# Altium schematic sheet Mainsystem.SchDoc
size A3; SheetNumber: 4; SheetTotal: 7
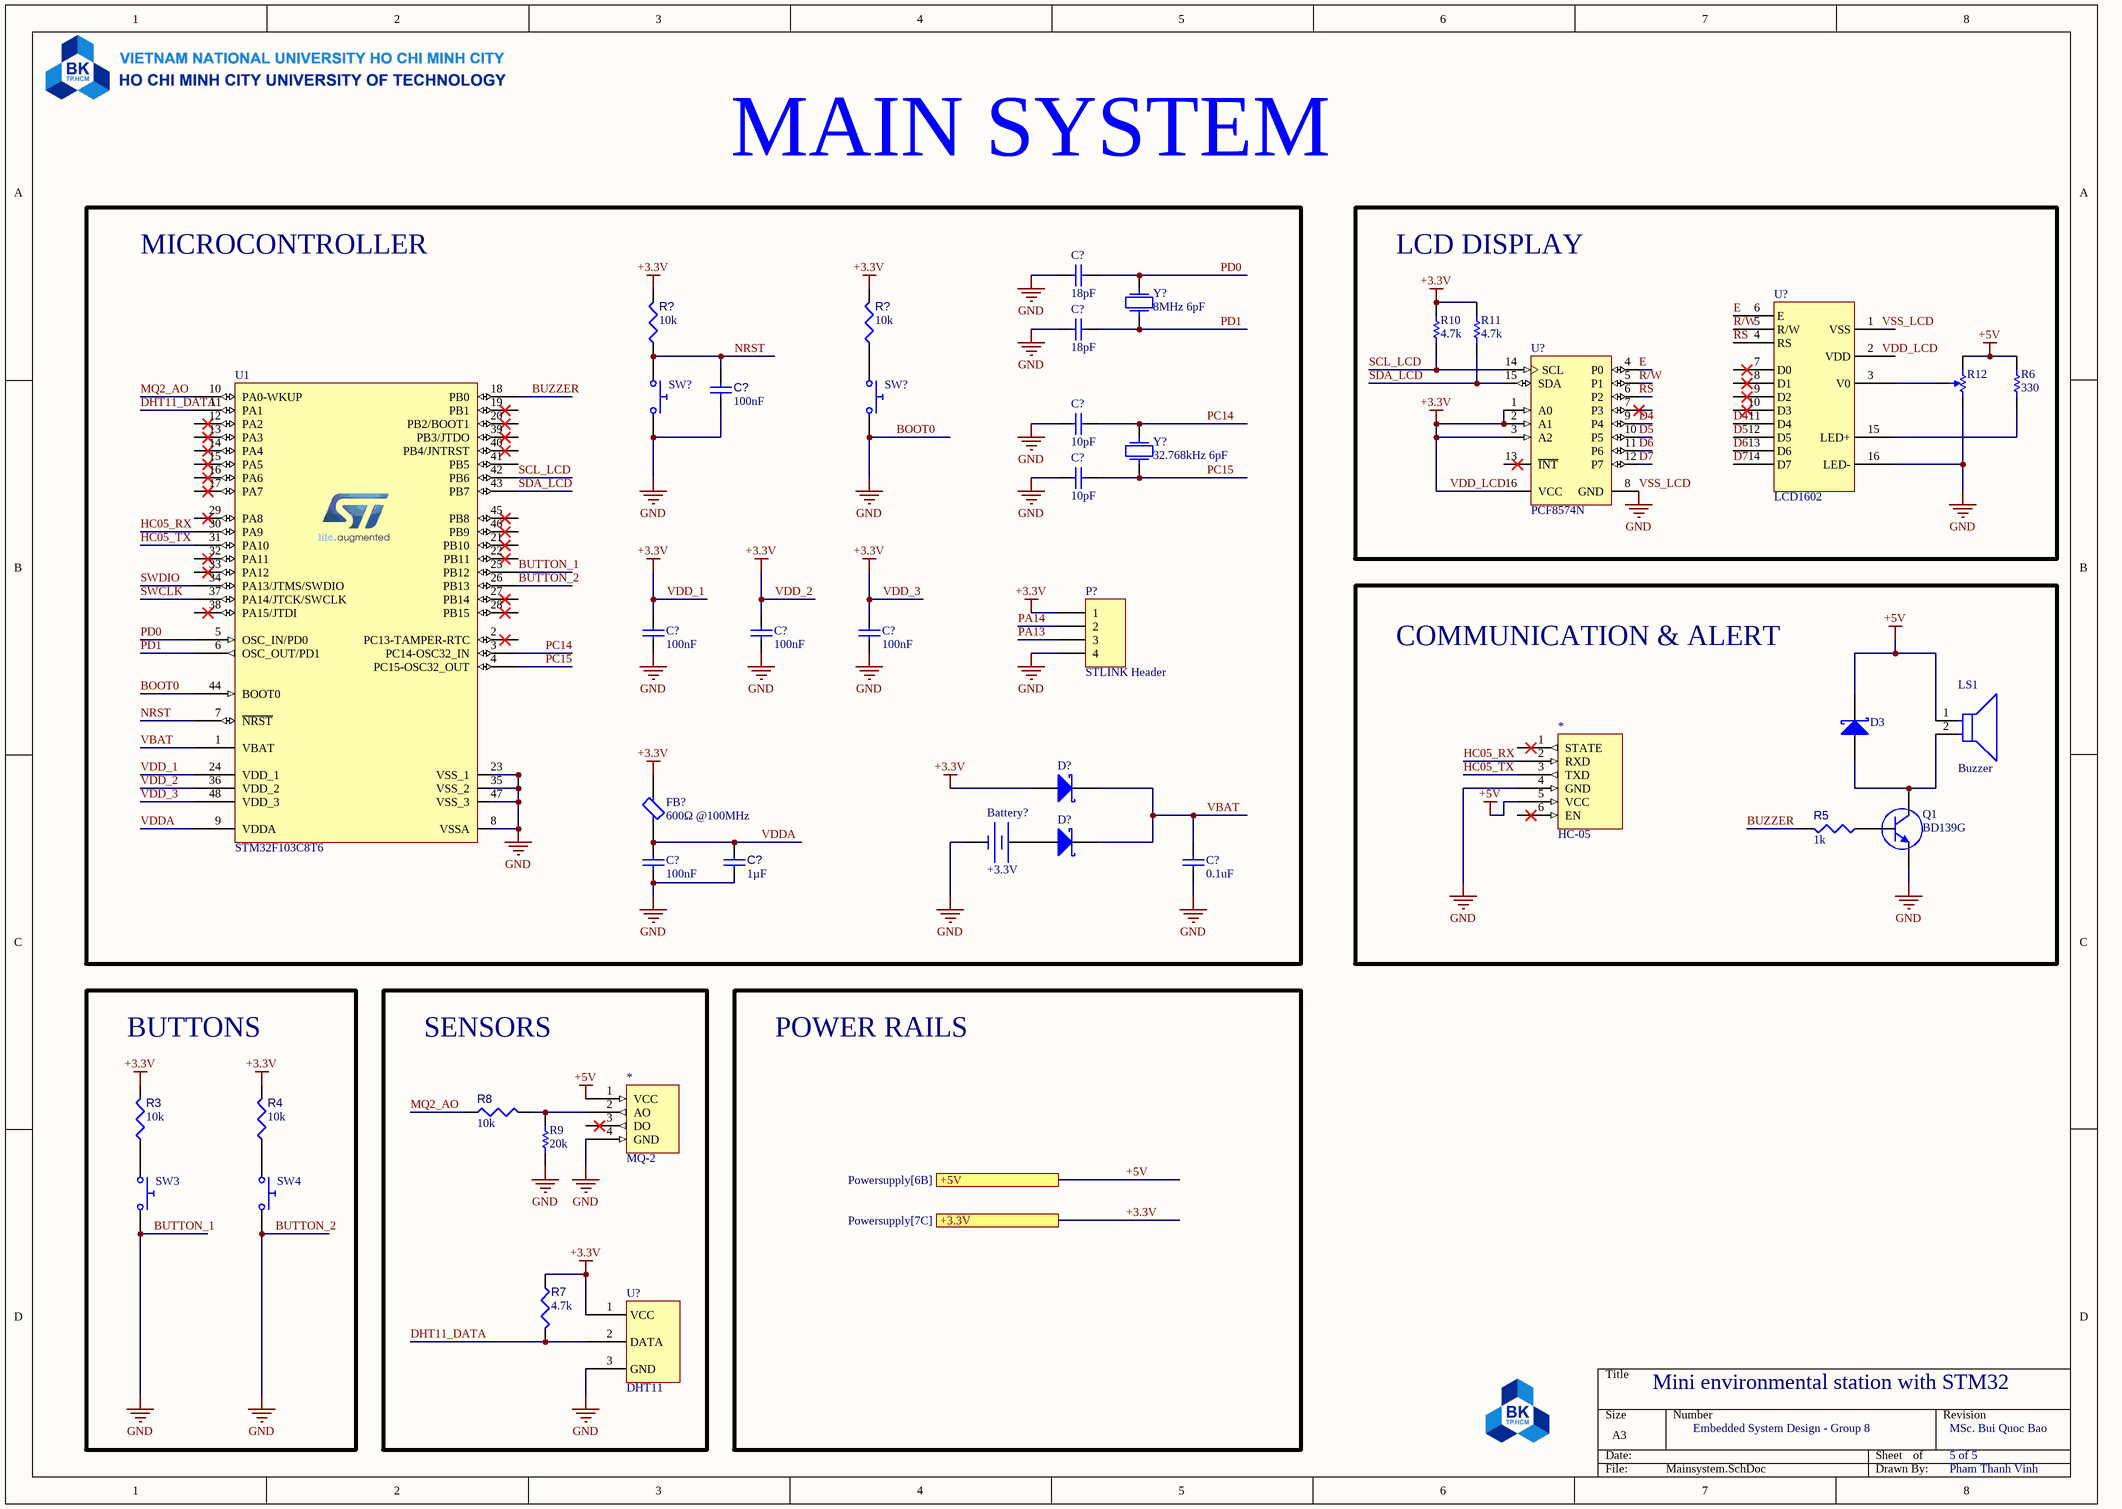
[diagram p0: Mainsystem.SchDoc]

## Parts
(Parts that share a designator on the sheet are numbered #1, #2 ... from top to bottom, then left to right.)
*#1  HC-05
*#2  MQ-2
Battery?  DC Magnitude: +3.3V  (hidden comment: Constant Voltage Source)
C?#1  value 18pF  (hidden comment: Capacitor)
C?#2  value 18pF  (hidden comment: Capacitor)
C?#3  value 100nF  [CAPC0402(1005)60_L]  (hidden comment: Capacitor 100nF +/-20% 10V 0402)
C?#4  value 10pF  (hidden comment: Capacitor)
C?#5  value 10pF  (hidden comment: Capacitor)
C?#6  value 100nF  (hidden comment: Capacitor)
C?#7  value 100nF  (hidden comment: Capacitor)
C?#8  value 100nF  (hidden comment: Capacitor)
C?#9  value 0.1uF  (hidden comment: Capacitor)
C?#10  value 100nF  (hidden comment: Capacitor)
C?#11  value 1µF  [CAPC1608X90X35ML15T15]  (hidden comment: Capacitor 1uF +/- 10% 16V 0603)
D3  Schottky Diode  (value not drawn)
D?#1  Schottky Diode  (value not drawn)
D?#2  Schottky Diode  (value not drawn)
FB?  600Ω @100MHz  [FP-BLM21-0_2-t0_85-e0_5-IPC_B]
LS1  Buzzer  [FP-CT-1205CL-SMT-TR-MFG]
P?  STLINK Header  [JP4]
Q1  BD139G
R3  value 10k  [RESC0402(1005)_L]  (hidden comment: 10KR2F)
R4  value 10k  [RESC0402(1005)_L]  (hidden comment: 10KR2F)
R5  value 1k  [RESC0402(1005)_L]  (hidden comment: 10KR2F)
R6  value 330  (hidden comment: Resistor)
R7  value 4.7k  [RESC0402(1005)_L]  (hidden comment: 10KR2F)
R8  value 10k  [RESC0402(1005)_L]  (hidden comment: 10KR2F)
R9  value 20k  (hidden comment: Resistor)
R10  value 4.7k  (hidden comment: Resistor)
R11  value 4.7k  (hidden comment: Resistor)
R12  TC33X-2-103E  [BOUR-TC33X-2_V]  (value not drawn)
R?#1  value 10k  [RESC0402(1005)_L]  (hidden comment: 10KR2F)
R?#2  value 10k  [RESC0402(1005)_L]  (hidden comment: 10KR2F)
SW3  Push Button Normally Opened  (value not drawn)
SW4  Push Button Normally Opened  (value not drawn)
SW?#1  Push Button Normally Opened  (value not drawn)
SW?#2  Push Button Normally Opened  (value not drawn)
U1  STM32F103C8T6  [STM32F103C8T6]
U?#1  LCD1602
U?#2  PCF8574N  [N0016A]
U?#3  DHT11
Y?#1  F0: 8MHz 6pF  (hidden comment: Crystal)
Y?#2  F0: 32.768kHz 6pF  (hidden comment: Crystal)

## Blocks framed on the sheet
MICROCONTROLLER: Battery? C?#1-C?#11 D?#1 D?#2 FB? P? R?#1 R?#2 SW?#1 SW?#2 U1 Y?#1 Y?#2
LCD DISPLAY: R6 R10-R12 U?#1 U?#2
COMMUNICATION & ALERT: *#1 D3 LS1 Q1 R5
BUTTONS: R3 R4 SW3 SW4
SENSORS: *#2 R7-R9 U?#3

## Ports
+3.3V (see Powersupply[7C]), +5V (see Powersupply[6B])

## Nets
+3.3V: C?#6.2 C?#7.2 C?#8.2 D?#1.1(A) FB?.2 P?.1 R3.2 R4.2 R7.1 R10.2 R11.2 R?#1.2 R?#2.2 U1.24(VDD_1) U1.36(VDD_2) U1.48(VDD_3) U?#2.1(A0) U?#2.2(A1) U?#2.3(A2) U?#2.16(VCC) U?#3.1(VCC) ; port +3.3V  [also labelled VDD_1, VDD_2, VDD_3, VDD_LCD]
+5V: *#1.5(VCC) *#2.1(VCC) D3.2(K) LS1.1(C) R6.2 R12.1 ; port +5V
BOOT0: *#1.4(GND) *#2.4(GND) Battery?.2 C?#1.1 C?#2.1 C?#3.1 C?#4.1 C?#5.1 C?#6.1 C?#7.1 C?#8.1 C?#9.2 C?#10.1 C?#11.1 P?.4 Q1.1(E) R9.1 R12.3 SW3.2 SW4.2 SW?#1.2 SW?#2.2 U1.8(VSSA) U1.23(VSS_1) U1.25(PB12) U1.26(PB13) U1.35(VSS_2) U1.44(BOOT0) U1.47(VSS_3) U?#1.16(LED-) U?#2.8(GND) U?#3.3(GND)  [also labelled BUTTON_1, BUTTON_2, GND, VSS_LCD]
BUZZER: R5.2 U1.18(PB0)
D4: U?#1.11(D4) U?#2.9(P4)
D5: U?#1.12(D5) U?#2.10(P5)
D6: U?#1.13(D6) U?#2.11(P6)
D7: U?#1.14(D7) U?#2.12(P7)
DHT11_DATA: R7.2 U1.11(PA1) U?#3.2(DATA)
E: U?#1.6(E) U?#2.4(P0)
HC05_RX: *#1.2(RXD) U1.30(PA9)
HC05_TX: *#1.3(TXD) U1.31(PA10)
MQ2_AO: R8.1 U1.10(PA0-WKUP)
NRST: C?#3.2 R?#1.1 SW?#1.1 U1.7(~{NRST})
PA13: P?.3
PA14: P?.2
PC14: C?#4.2 U1.3(PC14-OSC32_IN) Y?#2.2
PC15: C?#5.2 U1.4(PC15-OSC32_OUT) Y?#2.1
PD0: C?#1.2 U1.5(OSC_IN/PD0) Y?#1.2
PD1: C?#2.2 U1.6(OSC_OUT/PD1) Y?#1.1
R/W: U?#1.5(R/W) U?#2.5(P1)
RS: U?#1.4(RS) U?#2.6(P2)
SCL_LCD: R10.1 U1.42(PB6) U?#2.14(SCL)
SDA_LCD: R11.1 U1.43(PB7) U?#2.15(SDA)
SWCLK: U1.37(PA14/JTCK/SWCLK)
SWDIO: U1.34(PA13/JTMS/SWDIO)
VBAT: C?#9.1 D?#1.2(K) D?#2.2(K) U1.1(VBAT)
VDDA: C?#10.2 C?#11.2 FB?.1 U1.9(VDDA)
Net*#2_2: *#2.2(AO) R8.2 R9.2
NetBattery?_1: Battery?.1 D?#2.1(A)
NetD3_1: D3.1(A) LS1.2(A) Q1.3(C)
NetQ1_2: Q1.2(B) R5.1
NetR3_1: R3.1 SW3.1
NetR4_1: R4.1 SW4.1
NetR6_1: R6.1 U?#1.15(LED+)
NetR12_2: R12.2 U?#1.3(V0)
NetR?#2_1: R?#2.1 SW?#2.1

Not connected (* = marked no-connect by the designer): *#1 1(STATE) 6(EN); *#2 3(DO); U1 2(PC13-TAMPER-RTC) 12(PA2) 13(PA3) 14(PA4) 15(PA5) 16(PA6) 17(PA7) 19(PB1) 20(PB2/BOOT1) 21(PB10) 22(PB11) 27(PB14) 28(PB15) 29(PA8) 32(PA11) 33(PA12) 38(PA15/JTDI) 39(PB3/JTDO) 40(PB4/JNTRST) 41(PB5) 45(PB8) 46(PB9); U?#1 1(VSS) 2(VDD) 7(D0) 8(D1) 9(D2) 10(D3); U?#2 7(P3)* 13(~{INT})

## Notes on the sheet
- MAIN SYSTEM
- POWER RAILS
- Mini environmental station with STM32
- Embedded System Design - Group 8
- MSc. Bui Quoc Bao
- 5 of 5
- Pham Thanh Vinh
- Labels drawn without touching a wire or pin: VDD_LCD, VSS_LCD

## Library data of the parts
*#1 = CMP-00025-00003-1: Bluetooth module with UART communication
*#2 = CMP-00003-3: Gas sensor; Sensor Type: gas; Pins: 4
Battery? = Battery: SimulationGenericComponent: True
C?#1 C?#2 C?#4-C?#10 = Capacitor: SimulationGenericComponent: True
C?#3 = CMP-001-00061-3: Chip Capacitor, 100nF +/-20%, 10V, 0402, Thickness 0.6 mm; Tolerance: 20%; Mounting Technology: SMT; Voltage Rating: 10V; Max Operating Temperature: 85°C; Pins: 2; Case/Package: 0402; Min Operating Temperature: -55°C
C?#11 = CMP-001-00004-6: Chip Capacitor, 1 uF, +/- 10%, 16 V, 0603 (1608 Metric); Capacitor Type: Ceramic; Mounting Technology: SM; RoHS Compliant: True; Min Operating Temperature: -55°C; Case/Package: 0603; Pins: 2; Voltage Rating: 16V; Max Operating Temperature: 125°C; Tolerance: 10%
D3 D?#1 D?#2 = Schottky Diode: AF: 1; BV: 0; BV_MAX: 1e99; EG: 1.11; FC: 0.5; IBV: 0.001; IS: 1e-14; MJSW: 0.33; NTUN: 30; TNOM: 27; XTI: 3; SimulationGenericComponent: True; CJO: 0; CJP: 0; CTA: 0; CTP: 0; FCS: 0.5; FV_MAX: 1e99; IKF: 0; IKR: 0; ISR: 1e-14; JSW: 0; JTUN: 0; JTUNSW: 0; KEG: 1; KF: 0; LEVEL: 1; N: 1; NBV: 1; NR: 1; NS: 1; PHP: 1; RS: 0; TCV: 0; TLEV: 0; TLEVC: 0; TM1: 0; TM2: 0; TPB: 0; TPHP: 0; TRS: 0; TRS2: 0; TT: 0; TTT1: 0; TTT2: 0; VJ: 1; XTITUN: 3
FB? = CMP-06046-002585-1: Chip Ferrite Bead, 0805, 150Ω @ 100MHz, 0.21Ω, 25%, 600mA
LS1 = CMP-00027-00002-1: 12.8 mm, 5 Vdc, 92 dB, 2.4 kHz, Surface Mount (SMT), Driving Circuit, Magnetic Audio Indicator Buzzer; Mounting Technology: Surface Mount
P? = CMP-002-00100-1: Header, 4-Pin; Pins: 4; Source: PIF_Schematic_Lib.SchLib; LatestRevisionNote: Re-released for DXP Platform.; Component Type: Standard; Design Item ID: Header 4; LatestRevisionDate: 17-Jul-2002; Publisher: Altium Limited
Q1 = CMP-013-00037-1: 1.5 A, 80 V NPN Power Bipolar Junction Transistor. ONSSPCTRNSTLT1T0R;; Case/Package: TO-225; Pins: 3; Min Operating Temperature: -55°C; Max Operating Temperature: 150°C
R3-R5 R7 R8 R?#1 R?#2 = CMP-009-00066-2: 10K 0.063W 1% 0402 (1005 Metric)  SMD; Power: 63mW; Case/Package: 0402; Mounting Technology: SMT; Pins: 2; Tolerance: 1%
R6 R9-R11 = Resistor: TC1: 0; SimulationGenericComponent: True; TC2: 0
R12 = CMP-009-00060-2: Trimming Potentiometer, 10000 Ohm, -40 to 100 degC, 3-Pin SMD, RoHS, Tape and Reel; Manufacturer: Bourns; Tolerance: 25%; Power: 100mW; Resistance: 10k; Max Operating Temperature: 120°C; Package Description: 3-Pin Surface Mount Device, Body 3.8 x 3.6 mm; Datasheet Version: Aug-16; RoHS Compliant: True; Mounting Technology: SM; Package Quantity: 2500; Manufacturer URL: http://www.bourns.com/; Datasheet URL: http://www.bourns.com/docs/Product-Datasheets/TC33.pdf; Case/Package: TC33X-2; Package Reference: TC33X-2; Composition: Potentiometer; Packaging: TapeandReel; Min Operating Temperature: -40°C
SW3 SW4 SW?#1 SW?#2 = Push Button NO: closed: 0; Rclosed: 1m; Ropen: 1Meg; SimulationGenericComponent: True
U1 = CMP-031-00032-1: ARM Microcontrollers - MCU 32BIT Cortex M3 64KB 20KB RAM 2X12 ADC; Manufacture SN: STM32F103C8T6TR; Manufacturer: STM; Pad count: 48; Supplier 3 SN: STM32F103C8T6; Supplier 1 SN: 511-STM32F103C8T6; Supplier 3 URL: https://www.thegioiic.com/stm32f103c8t6-32-bit-arm-cortex-m3-microcontroller-72mhz-64kb-flash-48-lqfp; ComponentLink3Description: Supplier 2 URL; Value: STM32F103C8T6; Design Item ID: STM32F103C8T6; ComponentLink4Description: Supplier 3 URL; Supplier 2 SN: 497-17666-2-ND; ComponentLink2URL: https://www.mouser.com/ProductDetail/STMicroelectronics/STM32F103C8T6?qs=bhCVus9SdFtq6kqxsU5%2FDA%3D%3D; ComponentLink3URL: 497-17666-2-ND; Supplier 2 URL: https://www.digikey.com/en/products/detail/stmicroelectronics/stm32f103c8t6tr/2122442; Component Type: Standard; ComponentLink4URL: https://www.thegioiic.com/stm32f103c8t6-32-bit-arm-cortex-m3-microcontroller-72mhz-64kb-flash-48-lqfp; Supplier 1 URL: https://www.mouser.com/ProductDetail/STMicroelectronics/STM32F103C8T6?qs=bhCVus9SdFtq6kqxsU5%2FDA%3D%3D; ComponentLink1Description: Datasheet; Supplier 1 Name: Mouser; ComponentLink1URL: https://www.mouser.com/datasheet/2/389/stm32f103c8-1851025.pdf; Pins: 48; Part Number: STM32F103C8T6; ComponentLink2Description: Supplier 1 URL; Source: STM32.SchLib; Supplier 3 Name: thegioiic; Footprint name: LQFP48; Supplier 2 Name: Digi-Key
U?#2 = CMP-002-00117-1: 8-bit 2.5- to 5.5-V I2C/SMBus I/O expander with interrupt 16-PDIP -40 to 85; Case/Package: PDIP; Min Operating Temperature: -40°C; Pins: 16; Max Operating Temperature: 85°C
Y?#1 Y?#2 = Crystal: R: 500; Q: 50K; SimulationGenericComponent: True